# EAGLE design hr_monitor (EAGLE 7.4.0)
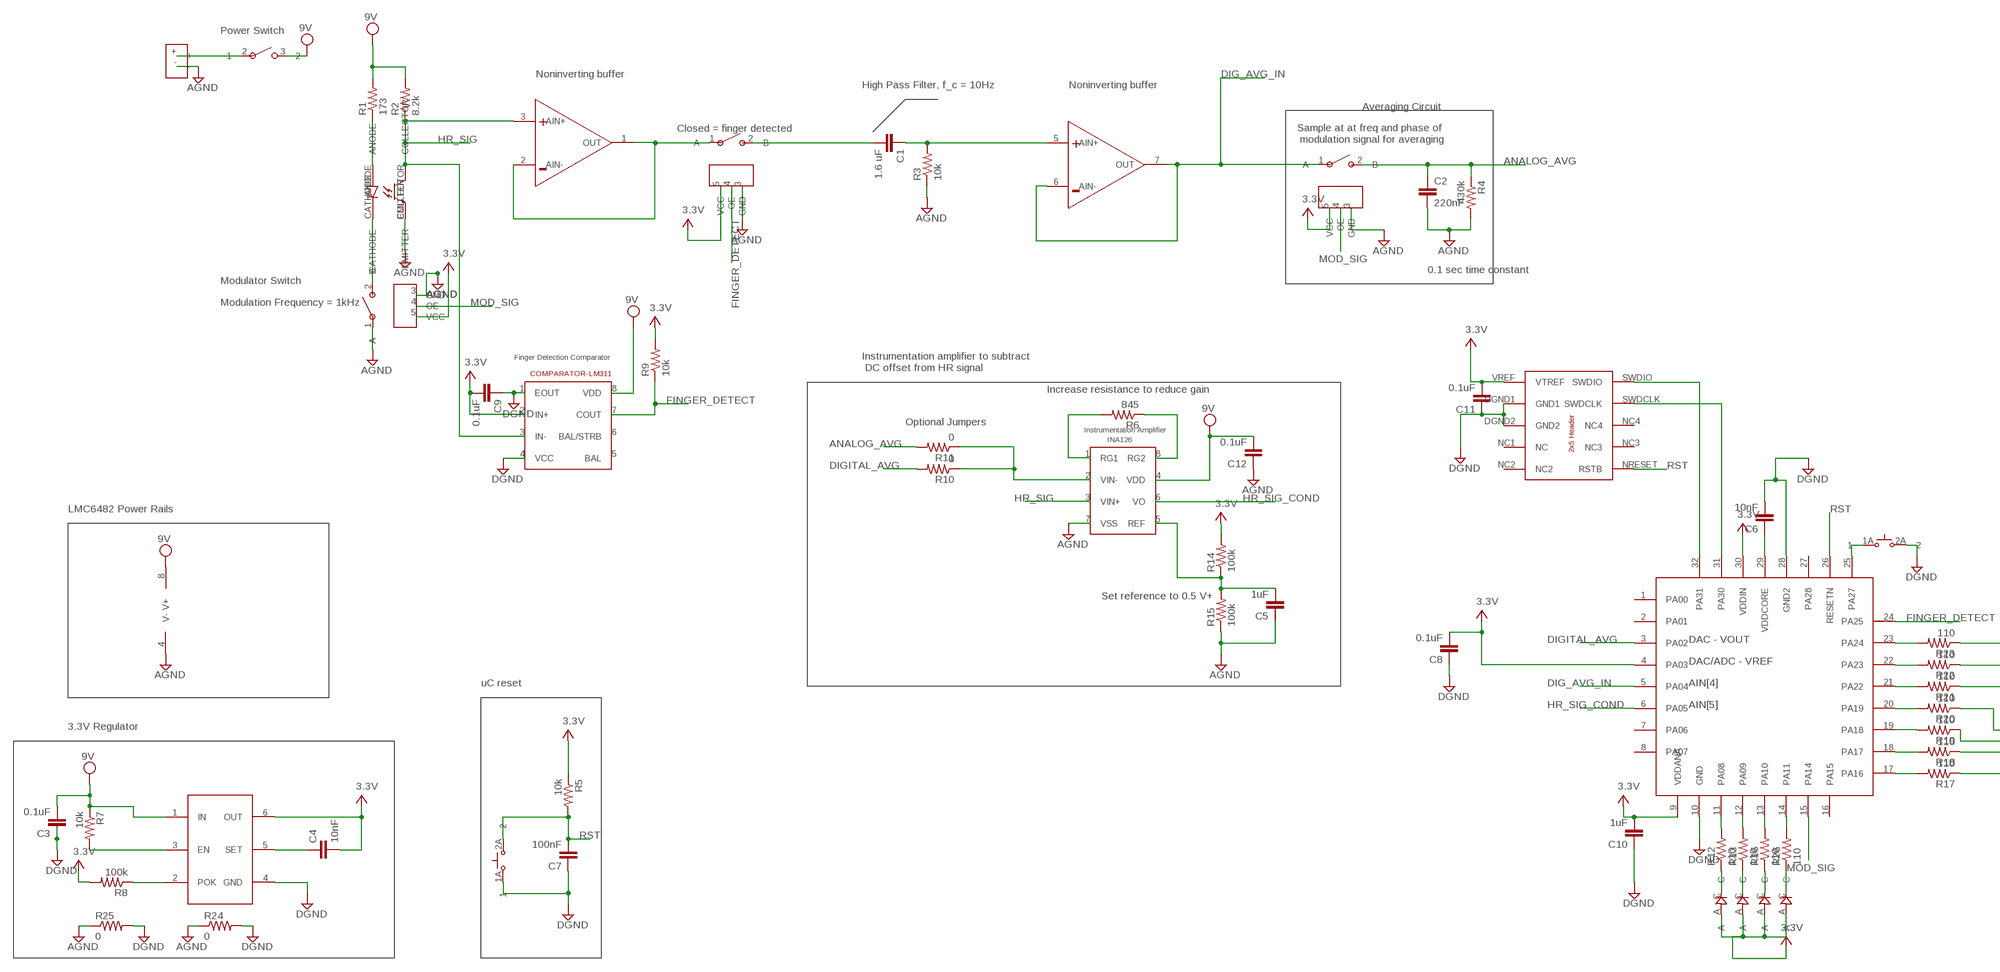
[diagram p0: schematic, sheet 1, part 1 of 2]
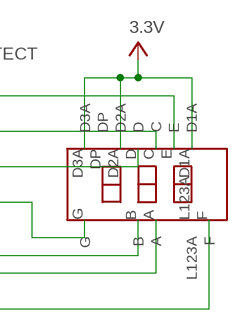
[diagram p1: schematic, sheet 1, part 2 of 2]

## Parts
C1  1.6 uF  C-EUC0805  [C0805]
C2  220nF  C-EUC0805  [C0805]
C3  0.1uF  C-EUC0805  [C0805]
C4  10nF  C-EUC0805  [C0805]
C5  1uF  C-EUC0805  [C0805]
C6  10nF  C-EUC0805  [C0805]
C7  100nF  C-EUC0805  [C0805]
C8  0.1uF  C-EUC0805  [C0805]
C9  0.1uF  C-EUC0805  [C0805]
C10  1uF  C-EUC0805  [C0805]
C11  0.1uF  C-EUC0805  [C0805]
C12  0.1uF  C-EUC0805  [C0805]
DBG1  DEBUGHEAD  [DEBUGHEAD]
R1  173  R-US_R0805  [R0805]
R2  8.2k  R-US_R0805  [R0805]
R3  10k  R-US_R0805  [R0805]
R4  430k  R-US_R0805  [R0805]
R5  10k  R-US_R0805  [R0805]
R6  845  R-US_R0805  [R0805]
R7  10k  R-US_R0805  [R0805]
R8  100k  R-US_R0805  [R0805]
R9  10k  R-US_R0805  [R0805]
R10  0  R-US_R0805  [R0805]
R11  0  R-US_R0805  [R0805]
R12  110  R-US_R0805  [R0805]
R13  110  R-US_R0805  [R0805]
R14  100k  R-US_R0805  [R0805]
R15  100k  R-US_R0805  [R0805]
R16  110  R-US_R0805  [R0805]
R17  110  R-US_R0805  [R0805]
R18  110  R-US_R0805  [R0805]
R19  110  R-US_R0805  [R0805]
R20  110  R-US_R0805  [R0805]
R21  110  R-US_R0805  [R0805]
R22  110  R-US_R0805  [R0805]
R23  110  R-US_R0805  [R0805]
R24  0  R-US_R0805  [R0805]
R25  0  R-US_R0805  [R0805]
R26  110  R-US_R0805  [R0805]
U1  SAMD21E  [TQFP32-08]
U2  3.3V_AS1363  [SOT23-6]
U$2  SPST  [SOT23]
U$3  INA126  [SOIC-8]
U$4  LM311  [SOIC8]
U$5  SPST  [SOT23]
U$6  LMC6482  [SOIC8]
U$7  SPST  [SOT23]
U$8  SWITCHPUSHBUTTON  [KMR7-SWITCH]
U$9  LED  [LED]
U$10  3DIG-7SEG-DISPLAY  [3-DIGIT-7SEG]
U$11  PWR-CONN  [THRU-HOLE-POWER]
U$12  SWITCH2  [DPDT-SLIDE-SWITCH]
U$13  SWITCHPUSHBUTTON  [KMR7-SWITCH]
U$14  LED  [LED]
U$15  LED  [LED]
U$16  LED  [LED]
U$17  TCRT1000  [TCRT1000]

## Nets
AGND: C2.2 C5.1 C12.1 R3.1 R4.2 R15.1 R24.1 R25.1 U$2.3(GND) U$3.7(VSS) U$5.1(A) U$5.3(GND) U$6.4(V-) U$7.3(GND) U$11.- U$17.EMITTER
ANALOG_AVG: C2.1 R4.1 R11.2 U$7.2(B)
DGND: C3.1 C6.2 C7.1 C8.1 C9.1 C10.1 C11.1 DBG1.DGND1(GND1) DBG1.DGND2(GND2) R24.2 R25.2 U1.10(GND) U1.28(GND2) U2.4(GND) U$4.1(EOUT) U$4.4(VCC) U$8.1A U$13.2A
DIG_AVG_IN: U1.5(PA04) U$6.6(AIN-) U$6.7(OUT) U$7.1(A)
DIGITAL_AVG: R10.2 U1.3(PA02)
FINGER_DETECT: R9.1 U1.24(PA25) U$2.4(OE) U$4.7(COUT)
HR_SIG: R2.1 U$3.3(VIN+) U$4.3(IN-) U$6.3(AIN+) U$17.COLLECTOR
HR_SIG_COND: U1.6(PA05) U$3.6(VO)
MOD_SIG: U1.15(PA14) U$5.4(OE) U$7.4(OE)
N$1: R1.1 U$17.ANODE
N$3: U$5.2(B) U$17.CATHODE
N$4: C1.2 U$2.2(B)
N$5: R12.2 U1.11(PA08)
N$6: C1.1 R3.2 U$6.5(AIN+)
N$7: U$2.1(A) U$6.1(OUT) U$6.2(AIN-)
N$8: R7.2 U2.3(EN)
N$9: R8.1 U2.2(POK)
N$10: C4.1 U2.5(SET)
N$11: R6.2 U$3.1(RG1)
N$12: R6.1 U$3.8(RG2)
N$13: R10.1 R11.1 U$3.2(VIN-)
N$14: C5.2 R14.1 R15.2 U$3.5(REF)
N$15: C6.1 U1.29(VDDCORE)
N$16: R13.2 U1.12(PA09)
N$17: R16.2 U1.13(PA10)
N$18: R23.1 U$10.E
N$19: R22.1 U$10.C
N$20: R12.1 U$9.C
N$21: R13.1 U$14.C
N$22: R16.1 U$15.C
N$23: R21.1 U$10.D
N$24: R20.1 U$10.G
N$25: R19.1 U$10.B
N$26: R18.1 U$10.A
N$27: R17.1 U$10.F
N$28: R19.2 U1.19(PA18)
N$29: R17.2 U1.17(PA16)
N$30: R18.2 U1.18(PA17)
N$31: R20.2 U1.20(PA19)
N$32: R21.2 U1.21(PA22)
N$33: R22.2 U1.22(PA23)
N$34: R23.2 U1.23(PA24)
N$35: DBG1.SWDIO U1.32(PA31)
N$36: DBG1.SWDCLK U1.31(PA30)
N$38: U$11.+ U$12.2
N$39: U1.25(PA27) U$13.1A
N$41: R26.1 U$16.C
N$42: R26.2 U1.14(PA11)
RST: C7.2 DBG1.NRESET(RSTB) R5.2 U1.26(RESETN) U$8.2A
V+: C4.2 C8.2 C9.2 C10.2 C11.2 DBG1.VREF(VTREF) R5.1 R8.2 R9.2 R14.2 U1.4(PA03) U1.9(VDDANA) U1.30(VDDIN) U2.6(OUT) U$2.5(VCC) U$4.2(IN+) U$5.5(VCC) U$7.5(VCC) U$9.A U$10.D1A U$10.D2A U$10.D3A U$14.A U$15.A U$16.A ; supply symbol labelled 3.3V
VDD: C3.2 C12.2 R1.2 R2.2 R7.1 U2.1(IN) U$3.4(VDD) U$4.8(VDD) U$6.8(V+) U$12.3 ; supply symbol labelled 9V
Unconnected: DBG1.NC1(NC) DBG1.NC2 DBG1.NC3 DBG1.NC4 U1.1(PA00) U1.2(PA01) U1.7(PA06) U1.8(PA07) U1.16(PA15) U1.27(PA28) U$4.5(BAL) U$4.6(BAL/STRB) U$10.DP U$10.L123A

## Notes on the sheet
- Power Switch
- Noninverting buffer
- High Pass Filter, f_c = 10Hz | Noninverting buffer
- Averaging Circuit
- Closed = finger detected
- Sample at at freq and phase of
   modulation signal for averaging
- 0.1 sec time constant
- Modulator Switch
- Modulation Frequency = 1kHz
- Finger Detection Comparator
- Instrumentation amplifier to subtract
   DC offset from HR signal
- Increase resistance to reduce gain
- Optional Jumpers
- LMC6482 Power Rails
- Set reference to 0.5 V+
- DAC - VOUT
- DAC/ADC - VREF
- uC reset | AIN[4]
- AIN[5]
- 3.3V Regulator

## Library data of the parts
C1-C12 = resistor:C-EU: CAPACITOR, European symbol
DBG1 = foe-scale:DEBUGHEAD
R1-R26 = resistor:R-US_: RESISTOR, American symbol
U1 = foe-scale:SAMD21E
U2 = foe-scale:3.3V_AS1363
U$2 U$5 U$7 = HR-MON:SPST
U$3 = HR-MON:INA126
U$4 = foe-scale:LM311
U$6 = foe-scale:LMC6482
U$8 U$13 = HR-MON:SWITCH
U$9 U$14-U$16 = HR-MON:LED
U$10 = HR-MON:3DIG-7SEG-DISPLAY
U$11 = HR-MON:PWR-CONN
U$12 = HR-MON:SWITCH2
U$17 = HR-MON:TCRT1000

## Board
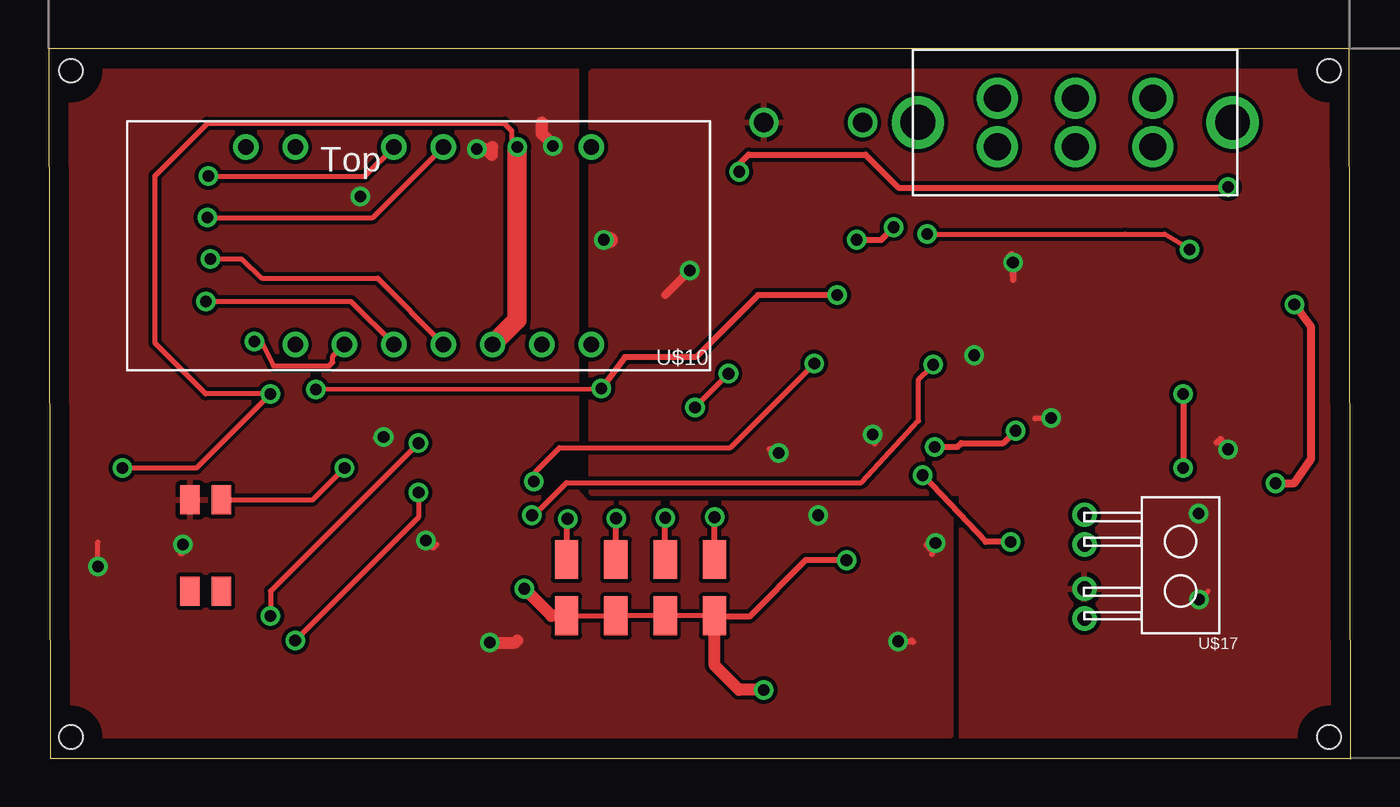
[diagram p2: board, top side]
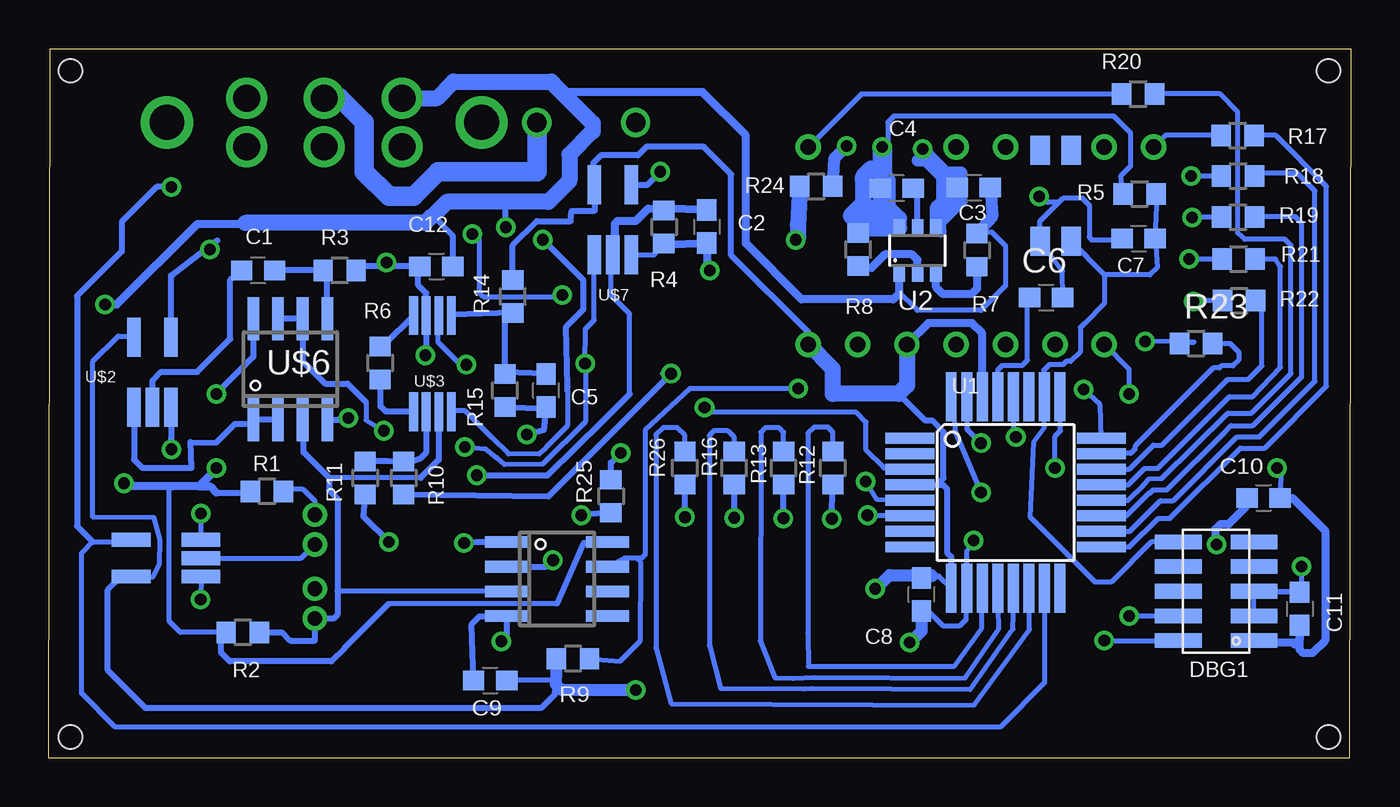
[diagram p3: board, bottom side, seen from below]

Size 67.06 x 36.53 mm. Coordinates in mm from the lower left corner, seen from the top.
Outline: 0.07,0 67.06,0 66.98,36.53 0,36.53 0.07,0
Copper layers (1*16): Top 0.035mm / dielectric 1.5mm / Bottom 0.035mm
Design rules "default": minimum track width 10mil, minimum drill 24mil, track to track 8mil, track to pad 8mil, pad to pad 8mil, via to via 8mil, smd to smd 8mil, copper to edge 40mil, drill to drill 8mil, minimum pad ring 10mil, minimum via ring 8mil, stop-mask expansion 4mil, vias tented up to drill 0mil, thermal gap 10mil
Holes 1.2 mm at 1.16,1.1 1.16,35.39 65.93,1.1 65.93,35.39

### Footprints (pad centres in the part's own frame; a part is rotated, then mirrored left to right if it is on the bottom)
C0805 = smd 1.1 x 1: 1 -0.85,0; 2 0.85,0
DEBUGHEAD = smd 0.76 x 2.4: DGND1 1.27,-3.9; DGND2 2.54,-3.9; NC1 3.81,-3.9; NC2 5.08,-3.9; NC3 3.81,0; NC4 2.54,0; NRESET 5.08,0; SWDCLK 1.27,0; SWDIO 0,0; VREF 0,-3.9
R0805 = smd 1 x 1.1: 1 -0.85,0; 2 0.85,0
TQFP32-08 = smd 2.54 x 0.559: 1 -4.928,2.8; 2 -4.928,2; 3 -4.928,1.2; 4 -4.928,0.4; 5 -4.928,-0.4; 6 -4.928,-1.2; 7 -4.928,-2; 8 -4.928,-2.8; 17 4.928,-2.8; 18 4.928,-2; 19 4.928,-1.2; 20 4.928,-0.4; 21 4.928,0.4; 22 4.928,1.2; 23 4.928,2; 24 4.928,2.8 | smd 0.559 x 2.54: 9 -2.8,-4.928; 10 -2,-4.928; 11 -1.2,-4.928; 12 -0.4,-4.928; 13 0.4,-4.928; 14 1.2,-4.928; 15 2,-4.928; 16 2.8,-4.928; 25 2.8,4.928; 26 2,4.928; 27 1.2,4.928; 28 0.4,4.928; 29 -0.4,4.928; 30 -1.2,4.928; 31 -2,4.928; 32 -2.8,4.928
SOT23-6 = smd 0.6 x 0.9: 1 -0.95,-1.15; 2 0,-1.15; 3 0.95,-1.15; 4 0.95,1.15; 5 0,1.15; 6 -0.95,1.15
SOT23 = smd 0.7 x 2: 1 0,0; 2 0.95,0; 3 1.9,0; 4 1.9,3.6; 5 0,3.6
SOIC-8 = smd 0.45 x 2: 1 0,0; 2 0.65,0; 3 1.3,0; 4 1.95,0; 5 1.95,4.95; 6 1.3,4.95; 7 0.65,4.95; 8 0,4.95
SOIC8 = smd 0.6 x 2.2: 1 -1.905,-2.6; 2 -0.635,-2.6; 3 0.635,-2.6; 4 1.905,-2.6; 5 1.905,2.6; 6 0.635,2.6; 7 -0.635,2.6; 8 -1.905,2.6
KMR7-SWITCH = smd 1.5 x 1: 1A 4.7,0; 1B 0,0; 2A 4.7,1.6; 2B 0,1.6
LED = smd 2 x 1.2: A 0,0; C 2.9,0
3-DIGIT-7SEG = drill 0.8: A 5.08,10.16; B 7.62,10.16; C 5.08,0; D 7.62,0; D1A 0,0; D2A 10.16,0; D3A 15.24,0; DP 12.7,0; E 2.54,0; F -2.54,10.16; G 15.24,10.16; L123A 0,10.16
THRU-HOLE-POWER = drill 1: + 0,0; - 5.08,0
DPDT-SLIDE-SWITCH = drill 1.4: 1 4.1,-1.25; 2 8.1,-1.25; 3 12.1,-1.25; 4 4.1,1.25; 5 8.1,1.25; 6 12.1,1.25 | drill 1.8: P$1 0,0; P$2 16.2,0
TCRT1000 = drill 0.75 pad 1.016: ANODE -0.127,0; CATHODE 1.397,0; COLLECTOR 5.207,0; EMITTER 3.683,0

### Placement (x,y rotation side)
C1  56.26,25.11 180 bottom
C2  33.16,27.36 270 bottom
C3  19.42,29.37 0 bottom
C4  23.39,29.34 180 bottom
C5  41.44,18.93 90 bottom
C6  15.69,23.72 0 bottom
C7  10.93,26.75 0 bottom
C8  22.11,8.43 90 bottom
C9  44.32,4.01 0 bottom
C10  4.51,13.41 0 bottom
C11  2.64,7.7 270 bottom
C12  47.09,25.32 0 bottom
DBG1  8.89,6.06 90 bottom
R1  55.82,13.74 180 bottom
R2  57.06,6.48 180 bottom
R3  52.07,25.11 180 bottom
R4  35.37,27.35 270 bottom
R5  10.89,29.05 0 bottom
R6  49.99,20.36 270 bottom
R7  19.26,26.15 270 bottom
R8  25.37,26.19 90 bottom
R9  40.05,5.13 180 bottom
R10  48.77,14.43 270 bottom
R11  50.76,14.43 270 bottom
R12  26.67,14.95 90 bottom
R13  29.21,14.95 90 bottom
R14  43.16,23.77 90 bottom
R15  43.55,18.94 90 bottom
R16  31.75,14.95 90 bottom
R17  5.83,32.06 0 bottom
R18  5.82,29.97 0 bottom
R19  5.81,27.86 0 bottom
R20  10.95,34.19 0 bottom
R21  5.78,25.7 0 bottom
R22  5.76,23.56 0 bottom
R23  7.97,21.36 0 bottom
R24  27.53,29.44 0 bottom
R25  38.1,13.49 270 bottom
R26  34.29,14.95 90 bottom
U1  17.78,13.68 0 bottom
U2  22.32,26.14 0 bottom
U$2  62.65,18.06 0 bottom
U$3  48.26,17.84 0 bottom
U$4  40.88,9.23 270 bottom
U$5  59.21,9.35 90 bottom
U$6  54.61,20.03 0 bottom
U$7  38.96,25.92 0 bottom
U$8  16,31.31 270 bottom
U$9  26.67,7.33 90 top
U$10  12.7,21.3 0 top
U$11  41.91,32.73 180 top
U$12  60.96,32.73 180 top
U$13  8.89,8.6 90 top
U$14  29.21,7.33 90 top
U$15  31.75,7.33 90 top
U$16  34.29,7.33 90 top
U$17  53.34,12.41 270 top

### Tracks (layer width: path | path; a pad name or v marks a point on that pad's centre or on a via)
AGND  (via drill 0.6)
  Top 0.254: v59.23,8.19 59.17,8.11 59.69,8.6 | v59.2,12.61 59.23,12.57
  Top 0.305: v49.65,25.53 49.67,24.62 49.6,25.97 49.46,25.82 | v47.65,20.75 47.65,20.68 47.44,20.47 | v37.6,15.72 37.33,15.72 37.14,15.91 | v42.44,16.66 42.53,16.21 | v60.74,15.91 60.35,16.44 60.16,16.24 60.14,16.24 | v51.61,17.51 50.8,17.49
  Top 0.406: v33.02,25.11 31.75,23.84
  Top 0.813: v28.59,26.69 28.89,26.69
  Bottom 0.254: U$5.1 v59.23,8.19 | U$5.3 v59.2,12.61 | U$7.3 35.85,25.92 R4.2
  Bottom 0.305: C12.1 50.91,25.32 R3.1 | C12.1 49.45,25.32 v49.65,25.53 | C12.1 48.03,25.31 48.03,24.36 47.61,23.95 U$3.7 47.61,20.78 v47.65,20.75 | R25.1 38.1,15.23 v37.6,15.72 | R15.1 41.45,17.99 C5.1 41.56,16.89 v42.44,16.66 | U$2.3 60.75,16.47 v60.74,15.91 | U$6.4 52.13,17.43 v51.61,17.51
  Bottom 0.406: R4.2 35.36,26.42 C2.2 33.16,25.25 v33.02,25.11
  Bottom 0.813: R24.1 28.48,27.44 28.46,27.42 28.46,26.82 v28.59,26.69
  pour Top: 27.94,35.27 27.94,13.68 46.99,13.68 46.99,-0.29 66.04,-0.29 67.31,0.98 67.31,35.27 66.04,36.54 29.21,36.54
ANALOG_AVG  (via drill 0.6)
  Top 0.305: v49.53,11.14 48.26,11.14 v45.01,14.57
  Bottom 0.254: 37.14,18.74 37.14,22.88 38.1,23.84 38.1,25.83 U$7.2
  Bottom 0.305: R11.2 50.85,12.46 v49.53,11.14 | v45.01,14.57 41.37,14.56 38.52,17.36 | 38.52,17.36 | 38.52,17.36 37.14,18.74
  Bottom 0.406: C2.1 35.36,28.32 R4.1 36.18,28.3 36.83,27.65 37.77,27.65 37.91,27.51 37.91,26.01 U$7.2
DGND  (via drill 0.6, 0.6 pad 0.25)
  Top 0.254: v19.42,11.21 19.78,10.82 19.98,11.02 | v16.05,28.92 16.09,28.79 16.28,28.99 | v17.25,16.55 16.86,16.48 16.82,16.52 | v2.54,9.87 2.54,11.14
  Top 0.305: v45.66,11.08 45.21,10.97 45.5,10.68 45.5,10.55 45.48,10.53 | v43.75,6.02 44.48,6.02 44.52,5.98 44.52,5.99 44.45,6.06 | v39.62,12.51 39.96,12.51
  Top 0.406: v6.92,11 6.92,10.69 6.83,10.6
  Top 0.61: v22.04,31.37 22.52,31.37 22.83,31.05 22.83,31.43 22.86,31.46 | v25.97,31.51 25.97,31.58 25.41,32.14 25.41,32.73 25.4,32.73 | v22.71,5.95 24.02,5.95 24.13,6.06
  Bottom 0.254: C8.1 21.68,7.48 21.02,6.83 20.14,6.83 19.81,7.16 19.81,8.73 U1.10 19.78,10.66 v19.42,11.21 | 16,27.64 U$8.1A 14.85,25.08 C6.2 | 16,27.64 14.79,28.85 13.85,28.85 13.48,28.48 13.48,26.82 13.35,26.69 11.94,26.69 C7.1 | 16,27.64 16,27.65 15.03,28.62 15.63,28.62 v16.05,28.92 | U1.28 17.38,16.57 v17.25,16.55 | C11.1 4.94,8.55 DBG1.DGND2 | DBG1.DGND1 DBG1.DGND2 | DBG1.DGND2 2.54,8.6 v2.54,9.87
  Bottom 0.305: C9.1 45.27,6.91 44.87,7.31 43.52,7.31 | 43.52,7.31 43.49,7.31 U$4.4 | U$4.1 45.01,11.13 v45.66,11.08 | 43.52,7.31 43.48,7.28 43.48,6.3 v43.75,6.02 | R25.2 39.59,12.54 v39.62,12.51
  Bottom 0.406: C10.1 5.46,12.89 6.31,12.04 6.75,12.04 6.99,11.79 6.99,11.07 v6.92,11
  Bottom 0.61: U2.4 21.36,28.38 C3.1 20.37,28.85 21.13,28.09 21.13,27.58 | 21.13,27.13 21.13,27.58 | 21.13,27.58 20.05,28.67 20.05,30.11 20.08,30.14 20.78,30.14 20.92,30 20.92,28.79 21.04,28.67 21.04,30.35 21.66,30.97 22.11,30.97 22.3,30.77 21.9,30.77 21.24,30.11 21.24,30.16 22.08,31 21.73,31 21.71,31.02 21.71,31.04 v22.04,31.37 | R24.2 26.58,30.9 v25.97,31.51 | C8.1 22.11,6.55 v22.71,5.95
  pour Top: 0,36.54 0,0.98 1.27,-0.29 44.95,-0.29 46.47,1.23 46.47,12.37 45.72,13.12 27.75,13.12 27.18,13.69 27.18,36.03 26.67,36.54
DIG_AVG_IN  (via drill 0.6)
  Top 0.254: v24.99,14.25 25.07,14.76 26.31,15.99 35.1,15.99 v39.43,20.32
  Top 0.305: v45.63,16.03 46.8,16.03 46.99,16.22 49.16,16.22 v49.79,16.86
  Bottom 0.254: U1.5 24.4,13.32 v24.99,14.25 | U$7.1 38.98,25.9 38.96,22.56 39.41,22.11 v39.43,20.32 39.38,20.27 39.38,17.36 41.59,15.16 43.58,15.13 43.98,15.47 44.55,15.92 v45.63,16.03 | 50.71,18.33 50.71,17.4 v49.79,16.86
  Bottom 0.305: U$6.7 U$6.6 53.98,20.45 52.81,19.28 51.66,19.28 50.71,18.33
DIGITAL_AVG  (via drill 0.6)
  Top 0.254: v33.28,18.05 33.28,18.07 v35.01,19.8
  Bottom 0.254: U1.3 22.79,14.88 22.86,14.95 24.06,14.95 24.96,15.86 24.96,17.31 25.46,17.8 33.03,17.8 v33.28,18.05 | v35.01,19.8 35.47,19.8
  Bottom 0.305: R10.2 41.32,13.48 v35.01,19.8
FINGER_DETECT  (via drill 0.6)
  Top 0.254: v13.77,18.99 v28.46,19.03 | v45.24,26.99 55.41,26.98 57.46,26.98 v58.76,26.2
  Top 0.305: v40.6,23.84 36.52,23.84 33.33,20.65 29.68,20.65 v28.46,19.03
  Bottom 0.254: U1.24 12.9,18.19 v13.77,18.99 | v28.46,19.03 34.04,19.02 36.33,16.88 36.33,10.49 36.51,10.31 36.77,10.31 | 36.77,10.31 37.41,10.31 U$4.7 | R9.1 37.63,5.01 36.59,6.06 36.56,10.09 36.77,10.31 | 40.75,23.77 44.67,23.77 44.87,23.96 44.87,26.69 v45.24,26.99
  Bottom 0.305: U$2.4 60.75,24.85 58.36,26.66 v58.76,26.2 | 40.75,23.77 v40.6,23.84
HR_SIG
  Bottom 0.254: 47.89,14.43 52.62,14.43 | U$4.3 52.17,8.59 52.18,8.6
  Bottom 0.305: R2.1 55.03,6.48 54.61,6.06 53.34,6.06 U$17.COLLECTOR 53.33,7.19 52.39,7.19 52.18,7.4 52.18,8.6 52.18,13.37 52.62,13.81 52.62,14.43 53.93,15.75 53.93,17.39 U$6.3 | U$3.3 46.96,15.36 47.89,14.43
HR_SIG_COND  (via drill 0.6)
  Top 0.254: v24.89,12.51 24.99,12.51 26.66,14.19 41.86,14.19 44.79,17.37 44.79,19.51 45.4,20.11 45.32,20.03 v45.55,20.26
  Bottom 0.254: U1.6 24.86,12.48 v24.89,12.51 | v45.55,20.26 45.84,20.26 46.99,21.41 46.99,22.77 U$3.6
MOD_SIG  (via drill 0.6)
  Top 0.305: v35.56,30.19 35.56,30.59 36.04,31.07 42.06,31.07 43.75,29.37 60.69,29.37 v60.73,29.41
  Bottom 0.254: U1.15 15.78,3.89 18.06,1.61 63.62,1.61 65.35,3.35 65.35,10.56 64.77,11.14 62.92,11.14 U$5.4
  Bottom 0.305: U$7.4 36.23,29.52 v35.56,30.19 | v60.73,29.41 61.49,29.41 63.29,27.61 63.29,26.1 65.59,23.8 65.59,11.96 64.77,11.14
N$1
  Bottom 0.254: U$17.ANODE 53.34,13.23 53.95,13.85 54.86,13.85 R1.1
N$3
  Bottom 0.254: U$5.2 54.05,10.3 U$17.CATHODE
N$4
  Bottom 0.305: U$2.2 61.7,19.46 61.27,19.89 59.4,19.89 57.7,21.59 57.7,24.62 C1.2
N$5
  Bottom 0.254: R12.2 26.67,16.79 26.93,17.05 27.63,17.05 27.96,16.72 27.96,6.42 27.93,4.73 20.41,4.75 19,6.7 19,8.73 U1.11
N$6
  Bottom 0.305: C1.1 55.31,25.11 R3.2 52.7,24.8 U$6.5
N$7
  Bottom 0.305: U$6.2 U$6.1 56.73,17.22 57.45,17.22 58.42,16.25 59.74,16.28 59.69,14.95 62.23,14.95 62.65,15.37 U$2.1
N$8
  Bottom 0.406: R7.2 19.25,24.18 19.53,23.9 21,23.9 21.36,24.26 U2.3
N$9
  Bottom 0.406: U2.2 22.32,25.65 22.6,25.94 23.99,25.94 24.35,25.58 24.68,25.25 R8.1
N$10
  Bottom 0.305: U2.5 22.32,29.05 C4.1
N$11
  Bottom 0.305: U$3.1 49.68,17.84 49.96,18.12 49.96,19.38 R6.2
N$12
  Bottom 0.305: R6.1 49.74,21.31 U$3.8
N$13
  Bottom 0.305: 50.32,15.35 R10.1 48.3,15.32 | R11.1 48.3,15.32 | 48.3,15.32 47.91,15.44 47.6,15.76 47.6,17.83 U$3.2
N$14
  Bottom 0.305: U$3.5 46.28,22.82 R14.1 43.55,22.43 R15.2 43.54,19.88 C5.2
N$15
  Bottom 0.254: U1.29 18.18,20 17.95,20.22 16.92,20.22 16.65,20.49 16.65,23.72 C6.1
N$16
  Bottom 0.254: R13.2 29.21,16.79 29.43,17.01 30.16,17.01 30.38,16.8 30.41,6.03 29.65,4.15 28.7,4.12 27.63,4.17 19.87,4.14 18.13,6.67 U1.12
N$17
  Bottom 0.254: R16.2 31.75,16.52 32.09,16.85 32.8,16.85 33.03,16.62 33.03,5.82 32.46,3.61 28.15,3.58 27.73,3.61 19.6,3.55 17.4,6.66 17.34,8.71 U1.13
N$18  (via drill 0.6)
  Top 0.254: v10.6,21.46 10.96,21.44 11.58,20.21 14.46,20.21 14.63,20.38 14.63,20.69 U$10.E
  Bottom 0.254: R23.1 8.07,21.42 v10.6,21.46
N$19  (via drill 0.6)
  Top 0.254: v8.1,23.52 15.56,23.52 U$10.C
  Bottom 0.254: R22.1 8.05,23.56 v8.1,23.52
N$20  (via drill 0.6)
  Top 0.305: U$9.C 26.7,12.2 v26.72,12.33
  Bottom 0.305: v26.72,12.33 26.7,13.97 R12.1
N$21  (via drill 0.6)
  Top 0.305: U$14.C 29.21,11.81 v29.22,12.35
  Bottom 0.305: v29.22,12.35 29.22,13.99 R13.1
N$22  (via drill 0.6)
  Top 0.305: U$15.C 31.75,11.95 v31.74,12.38
  Bottom 0.305: v31.74,12.38 31.74,14 R16.1
N$23  (via drill 0.6)
  Top 0.254: v8.33,25.71 9.94,25.71 10.97,24.72 16.95,24.72 U$10.D
  Bottom 0.254: R21.1 v8.32,25.7 v8.33,25.71
N$24
  Bottom 0.254: R20.1 25.21,34.19 U$10.G
N$25  (via drill 0.6)
  Top 0.254: v8.18,27.83 16.69,27.83 U$10.B
  Bottom 0.254: R19.1 8.15,27.86 v8.18,27.83
N$26  (via drill 0.6)
  Top 0.254: v8.23,29.97 16.29,29.97 U$10.A
  Bottom 0.254: R18.1 v8.23,29.97
N$27
  Bottom 0.254: R17.1 9.56,32.06 U$10.F
N$28
  Bottom 0.254: U1.19 11.57,12.48 10.39,13.67 10.33,13.67 10.17,13.82 9.48,13.82 6.48,16.82 | 6.48,16.82 | 6.48,16.82 6.18,17.12 5.06,17.12 2.54,19.64 2.54,27.55 2.88,27.88 4.84,27.88 R19.2
N$29
  Bottom 0.254: U1.17 11.4,10.88 9.92,12.35 9.31,12.35 5.7,15.97 4.44,15.97 1.26,19.15 1.26,29.45 3.88,32.06 4.88,32.06 R17.2
N$30
  Bottom 0.254: U1.18 11.4,11.68 9.81,13.27 9.15,13.27 5.87,16.54 4.71,16.54 1.86,19.4 1.86,29.21 2.77,30.12 4.72,30.12 R18.2
N$31
  Bottom 0.254: U1.20 11.48,13.28 10.67,14.09 | 10.67,14.09 | 10.67,14.09 10.39,14.39 9.73,14.41 6.34,17.77 5.12,17.77 3.1,19.8 3.1,26.4 3.4,26.71 5.47,26.71 5.83,27.03 5.83,33.27 6.73,34.2 9.99,34.2 R20.2
N$32
  Bottom 0.254: U1.21 11.47,14.08 10.62,14.93 9.94,14.93 6.26,18.61 5.05,18.61 3.64,20.11 3.64,25.3 3.89,25.69 4.82,25.69 R21.2
N$33
  Bottom 0.254: U1.22 11.41,14.88 10.18,16.12 9.74,16.12 6.35,19.5 5.28,19.5 4.58,20.2 4.58,23.33 R22.2
N$34
  Bottom 0.254: R23.2 6.23,21.36 5.78,20.91 5.78,20.49 6.08,20.2 6.67,20.2 6.77,20.09 7.08,20.09 11.12,16.06 11.12,15.91 11.33,15.7 12.84,15.7 U1.23
N$35  (via drill 0.6)
  Top 0.254: v19.05,13.68 19.05,12.41 v12.7,6.06
  Bottom 0.254: U1.32 20.38,16.79 v19.05,13.68 | v12.7,6.06 DBG1.SWDIO
N$36  (via drill 0.6)
  Top 0.254: v19.05,16.22 11.43,8.6 v11.43,7.33
  Bottom 0.254: U1.31 19.78,16.95 v19.05,16.22 | v11.43,7.33 DBG1.SWDCLK
N$38
  Bottom 1.016: U$11.+ 41.91,30.19 46.99,30.19 48.26,28.92 49.53,28.92 50.8,30.19 50.8,32.73 52.07,34 52.84,34 U$12.2
N$39  (via drill 0.6)
  Top 0.254: U$13.1A 13.59,13.3 v15.24,14.95
  Bottom 0.254: v15.24,14.95 15.24,16.57 14.96,16.85 14.96,18.59 U1.25
N$41  (via drill 0.6)
  Top 0.305: U$16.C v34.29,12.41
  Bottom 0.305: v34.29,12.41 R26.1
N$42
  Bottom 0.254: R26.2 34.29,16.62 34.7,17.02 35.4,17.02 35.78,16.65 35.78,5.69 35,2.82 19.41,2.73 16.55,6.63 16.55,8.73 U1.14
RST
  Bottom 0.254: R5.2 9.98,29.01 C7.2 9.98,25.26 10.35,24.89 12.69,24.89 | 12.69,24.89 U$8.2A | 12.69,24.89 12.69,23.43 13.74,22.38 | 13.74,22.38 | 13.74,22.38 13.94,22.18 13.94,20.91 14.42,20.43 14.65,20.43 14.82,20.26 15.54,20.26 15.81,19.99 15.81,18.64 U1.26 15.79,18.6 15.79,17.02 16.32,16.3 16.51,12.41 13.17,9.07 12.34,9.07 10.27,11.14 DBG1.NRESET
V+  (via drill 0.6)
  Top 0.254: U$9.A U$14.A U$15.A U$16.A | v3.81,14.95 7.62,14.95 v11.43,18.76 8.09,18.76 5.48,21.37 5.48,29.99 8.18,32.69 23.46,32.69 23.85,32.31 23.85,31.74 v24.13,31.46
  Top 0.305: v41.08,10.2 38.98,10.2 36.08,7.3 34.32,7.3 U$16.A
  Top 0.61: v36.83,3.52 35.56,3.52 34.29,4.79 U$16.A | U$9.A 25.9,7.33 v24.5,8.73
  Top 1.016: v24.13,31.46 24.13,22.57 U$10.D2A
  Bottom 0.254: C8.2 21.57,9.38 21.21,9.38 U1.9 | R5.1 11.84,29.99 11.34,30.49 11.34,32.18 12.21,33.05 23.53,33.05 23.85,32.74 23.85,31.74 v24.13,31.46 | R9.2 41.08,4.02 C9.2 | 24.2,29.35 24.2,29 24.13,28.92 | 63.63,9.35 63.33,9.35 U$5.5 61.69,9.33 61.34,10.02 61.31,11.25 61.62,12.39 64.77,12.41 64.77,20.43 63.47,21.73 62.72,21.73 U$2.5 | C10.2 3.56,14.7 v3.81,14.95 | U$10.D1A 11.43,20.03 v11.43,18.76
  Bottom 0.305: U1.4 21.31,14.08 | 21.31,14.08 20.97,14.42 20.97,16.8 21.55,17.38 21.91,17.38 23.29,18.76 | 21.31,14.08 21,14.08 20.79,13.87 20.79,10.59 20.59,10.39 20.59,8.76 U1.9 | R14.2 43.16,26.41 41.91,27.65 40.17,27.65 40.12,28.18 38.93,28.19 38.91,29.54 38.95,29.54 U$7.5 39.02,29.58 39.02,30.63 38.62,31.03 36.71,31.03 36.26,31.48 33.33,31.48 31.91,30.06 31.91,25.9 27.94,21.93 U$10.D3A | R9.2 41,3.28 41.7,2.58 62.06,2.58 64.01,4.53 64.01,8.67 63.33,9.35 | U$4.2 41.42,9.86 v41.08,10.2
  Bottom 0.406: U1.4 | U1.30 18.98,21.87 19.51,22.41 21.75,22.41 U$10.D2A | C10.2 3.02,13.41 1.33,11.72 1.33,6.06 1.98,5.41 2.45,5.41 2.65,5.61 2.65,6.74 C11.2 2.64,6.12 2.91,5.85 2.91,5.94 2.89,5.96 4.89,5.96 DBG1.VREF
  Bottom 0.61: R9.2 40.94,3.82 40.64,3.52 v36.83,3.52 | v24.5,8.73 24.45,8.73 23.75,9.43 21.62,9.43 21.57,9.38
  Bottom 0.813: U2.6 23.27,27.77 23.57,28.08 | 23.57,28.08 23.91,28.08 24.17,28.33 24.86,28.33 24.87,28.32 25.29,28.32 25.74,27.88 | 25.74,27.88 24.3,27.88 23.67,27.25 25.27,27.25 R8.2 | C4.2 24.2,29.35 23.86,29.69 23.86,28.37 23.57,28.08 | 25.74,27.88 25.74,27.96 25.11,28.59 25.11,29.68 25.12,29.69 25.12,29.95 24.71,30.37 24.42,30.37 23.88,29.82 23.88,27.27 | U$10.D2A 22.86,19.19 23.29,18.76 26.67,18.76 26.67,20.03 U$10.D3A
  Bottom 1.016: 24.13,28.92 v24.13,31.46
VDD  (via drill 0.6)
  Top 0.305: v58.42,18.76 v58.42,14.95 | v41.6,26.69 42.87,26.69 v43.51,27.33
  Top 0.406: v63.18,14.16 64.14,14.16 65,15.41 65,22.2 v64.14,23.36
  Bottom 0.254: 40.89,7.96 49.55,7.95 | R7.1 18.5,27.1 17.78,26.38 17.78,24.32 19.04,23.06 22.32,23.06 23.29,24.02 23.29,24.97 U2.1 | R2.2 60.27,6.48 60.83,7.05 60.83,13.88 60.71,14 | 40.34,18.92 40.34,17.12 41.42,16.03 41.55,15.87 41.79,15.65 43.38,15.67 44.21,16.5 44.27,16.55 45.61,17.89 46.27,17.89 U$3.4
  Bottom 0.305: U$4.8 39.51,11.07 40.89,7.96 | 49.55,7.95 51.84,5.65 | 51.84,5.65 | 51.84,5.65 52.5,4.99 57.72,4.99 58.17,5.44 58.17,6.32 R2.2 | U$6.8 56.52,20.67 v58.42,18.76 | 58.42,13.68 56.83,13.68 R1.2 | C12.2 46.23,26.88 47.27,27.92 | 40.34,18.92 40.33,19.13 40.4,22.22 39.52,23.11 39.52,24.61 v41.6,26.69 | v43.51,27.33 43.51,28.57 43.58,28.64
  Bottom 0.406: v58.42,14.95 58.42,14.87 59.29,14 | 59.29,14 60.71,14 63.02,14 v63.18,14.16 | v64.14,23.36 63.54,23.36 59.39,27.51 56.95,27.51 56.91,27.56 | 59.29,14 58.74,14 58.42,13.68 | U2.1 23.27,23.92 23.56,23.62 28.28,23.62 31.16,26.5 31.16,32.06 33.38,34.29 40.63,34.29 41.05,34.7
  Bottom 0.61: C3.2 18.47,27.89 R7.1
  Bottom 0.813: U$12.3 47.06,33.98 46.22,34.83 41.17,34.83 41.05,34.7 39.04,32.69 39.04,32.27 40.24,31.07 40.24,29.72 41.32,28.64 43.58,28.64 46.55,28.64 47.27,27.92 47.3,27.92 47.66,27.56 56.91,27.56